# Altium schematic sheet Wi-Fi, DEBUG.SchDoc
size A
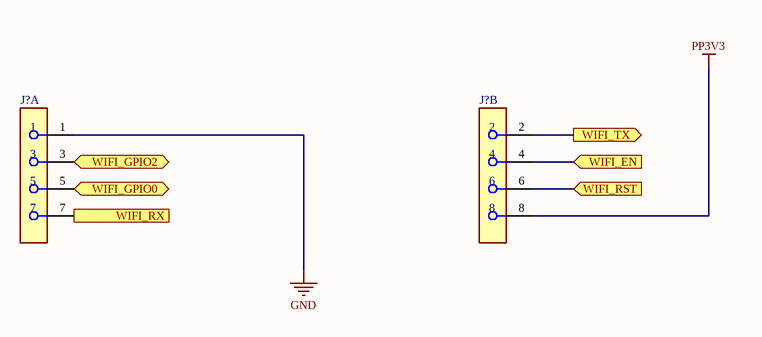
[diagram p0: Wi-Fi, DEBUG.SchDoc]

## Parts
(Parts that share a designator on the sheet are numbered #1, #2 ... from top to bottom, then left to right.)
J?#1  PPTC042LFBN-RC  [FP-PPTC042LFBN-RC-MFG]  (value not drawn)  (part A of 2)
J?#2  PPTC042LFBN-RC  [FP-PPTC042LFBN-RC-MFG]  (value not drawn)  (part B of 2)

## Ports
WIFI_EN (in), WIFI_GPIO0 (bidir), WIFI_GPIO2 (bidir), WIFI_RST (in), WIFI_RX (in), WIFI_TX (out)

## Nets
GND: J?#1.1
PP3V3: J?#2.8
WIFI_EN: J?#2.4 ; port WIFI_EN
WIFI_GPIO0: J?#1.5 ; port WIFI_GPIO0
WIFI_GPIO2: J?#1.3 ; port WIFI_GPIO2
WIFI_RST: J?#2.6 ; port WIFI_RST
WIFI_RX: J?#1.7 ; port WIFI_RX
WIFI_TX: J?#2.2 ; port WIFI_TX

## Library data of the parts
J?#1 J?#2 = CMP-25680-000004-1: CONN HDR 8POS 0.1 TIN PCB; Manufacturer: Sullins Connector Solutions; Is Female: yes; Conn Orientation: Straight; Conn Gender: Female; Number Of Contacts: 8; Description: 8 Position Header Connector 0.100" (2.54mm) Through Hole Tin; Pitch: 2.54mm; Voltage Rating: 250V; Current Rating: 3A; Package: PPTC042LFBN-RC; Number Of Rows: 2; Contact Material: Tin,Nickel; Temperature: -40°C to +105°C; Height: 8.65mm; Device Class L2: Headers and Wire Housings; Octopart: https://octopart.com/pptc042lfbn-rc-sullins-271088; RoHS: TRUE; ComponentLink2URL: https://drawings-pdf.s3.amazonaws.com/10492.pdf; Lead Free: Yes; Automotive: No; Device Class L3: unset; ComponentLink2Description: Datasheet; Temperature Range High: +105°C; Digikey Description: CONN HDR 8POS 0.1 TIN PCB; Category: Conn; Device Class L1: Connectors; Temperature Range Low: -40°C; Supplier: Digi-Key; Supplier Part Number: S7072-ND; Manufacturer Part Number: PPTC042LFBN-RC